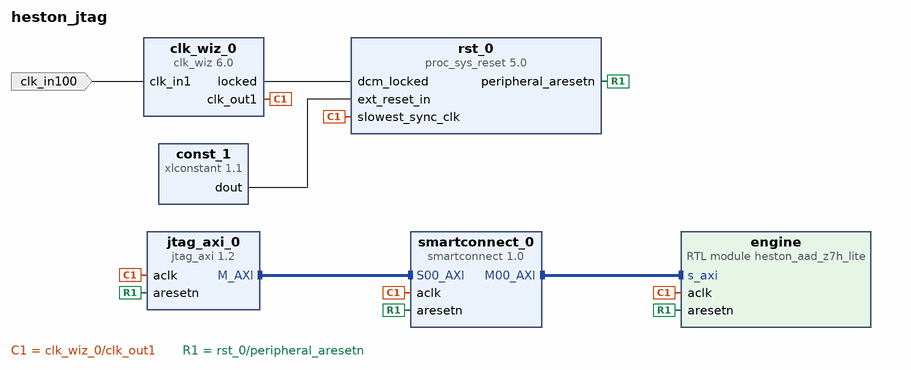
[diagram p0: block diagram of the top level]
# Vivado block design heston_jtag, xc7z020clg484-1, Vivado 2025.2
create_bd_design heston_jtag

create_bd_port -dir I -type clk clk_in100

create_bd_cell -type ip -vlnv xilinx.com:ip:clk_wiz:6.0 clk_wiz_0
set_property -dict [list \
  CONFIG.CLKOUT1_REQUESTED_OUT_FREQ 70.000 \
  CONFIG.PRIM_IN_FREQ 100.000 \
  CONFIG.PRIM_SOURCE Single_ended_clock_capable_pin \
  CONFIG.USE_LOCKED true \
  CONFIG.USE_RESET false \
] [get_bd_cells clk_wiz_0]
create_bd_cell -type ip -vlnv xilinx.com:ip:jtag_axi:1.2 jtag_axi_0
set_property -dict {CONFIG.PROTOCOL 2} [get_bd_cells jtag_axi_0]
create_bd_cell -type ip -vlnv xilinx.com:ip:proc_sys_reset:5.0 rst_0
create_bd_cell -type ip -vlnv xilinx.com:ip:smartconnect:1.0 smartconnect_0
set_property -dict {CONFIG.NUM_MI 1 CONFIG.NUM_SI 1} [get_bd_cells smartconnect_0]
create_bd_cell -type module -reference heston_aad_z7h_lite engine
create_bd_cell -type ip -vlnv xilinx.com:ip:xlconstant:1.1 const_1
set_property -dict {CONFIG.CONST_VAL 1 CONFIG.CONST_WIDTH 1} [get_bd_cells const_1]

# ---- connections ----

connect_bd_intf_net [get_bd_intf_pins jtag_axi_0/M_AXI] [get_bd_intf_pins smartconnect_0/S00_AXI]
connect_bd_intf_net [get_bd_intf_pins smartconnect_0/M00_AXI] [get_bd_intf_pins engine/s_axi]
connect_bd_net -net clk_in100_1 [get_bd_ports clk_in100] [get_bd_pins clk_wiz_0/clk_in1]
connect_bd_net [get_bd_pins clk_wiz_0/clk_out1] \
  [get_bd_pins rst_0/slowest_sync_clk] [get_bd_pins jtag_axi_0/aclk] [get_bd_pins smartconnect_0/aclk] \
  [get_bd_pins engine/aclk]
connect_bd_net [get_bd_pins clk_wiz_0/locked] [get_bd_pins rst_0/dcm_locked]
connect_bd_net [get_bd_pins const_1/dout] [get_bd_pins rst_0/ext_reset_in]
connect_bd_net [get_bd_pins rst_0/peripheral_aresetn] \
  [get_bd_pins jtag_axi_0/aresetn] [get_bd_pins smartconnect_0/aresetn] [get_bd_pins engine/aresetn]

# ---- address map ----
assign_bd_address -offset 0x00000000 -range 4K -target_address_space [get_bd_addr_spaces jtag_axi_0/Data] [get_bd_addr_segs engine/s_axi/reg0]

validate_bd_design
save_bd_design
